# Altium project PCB_Project.PrjPcb
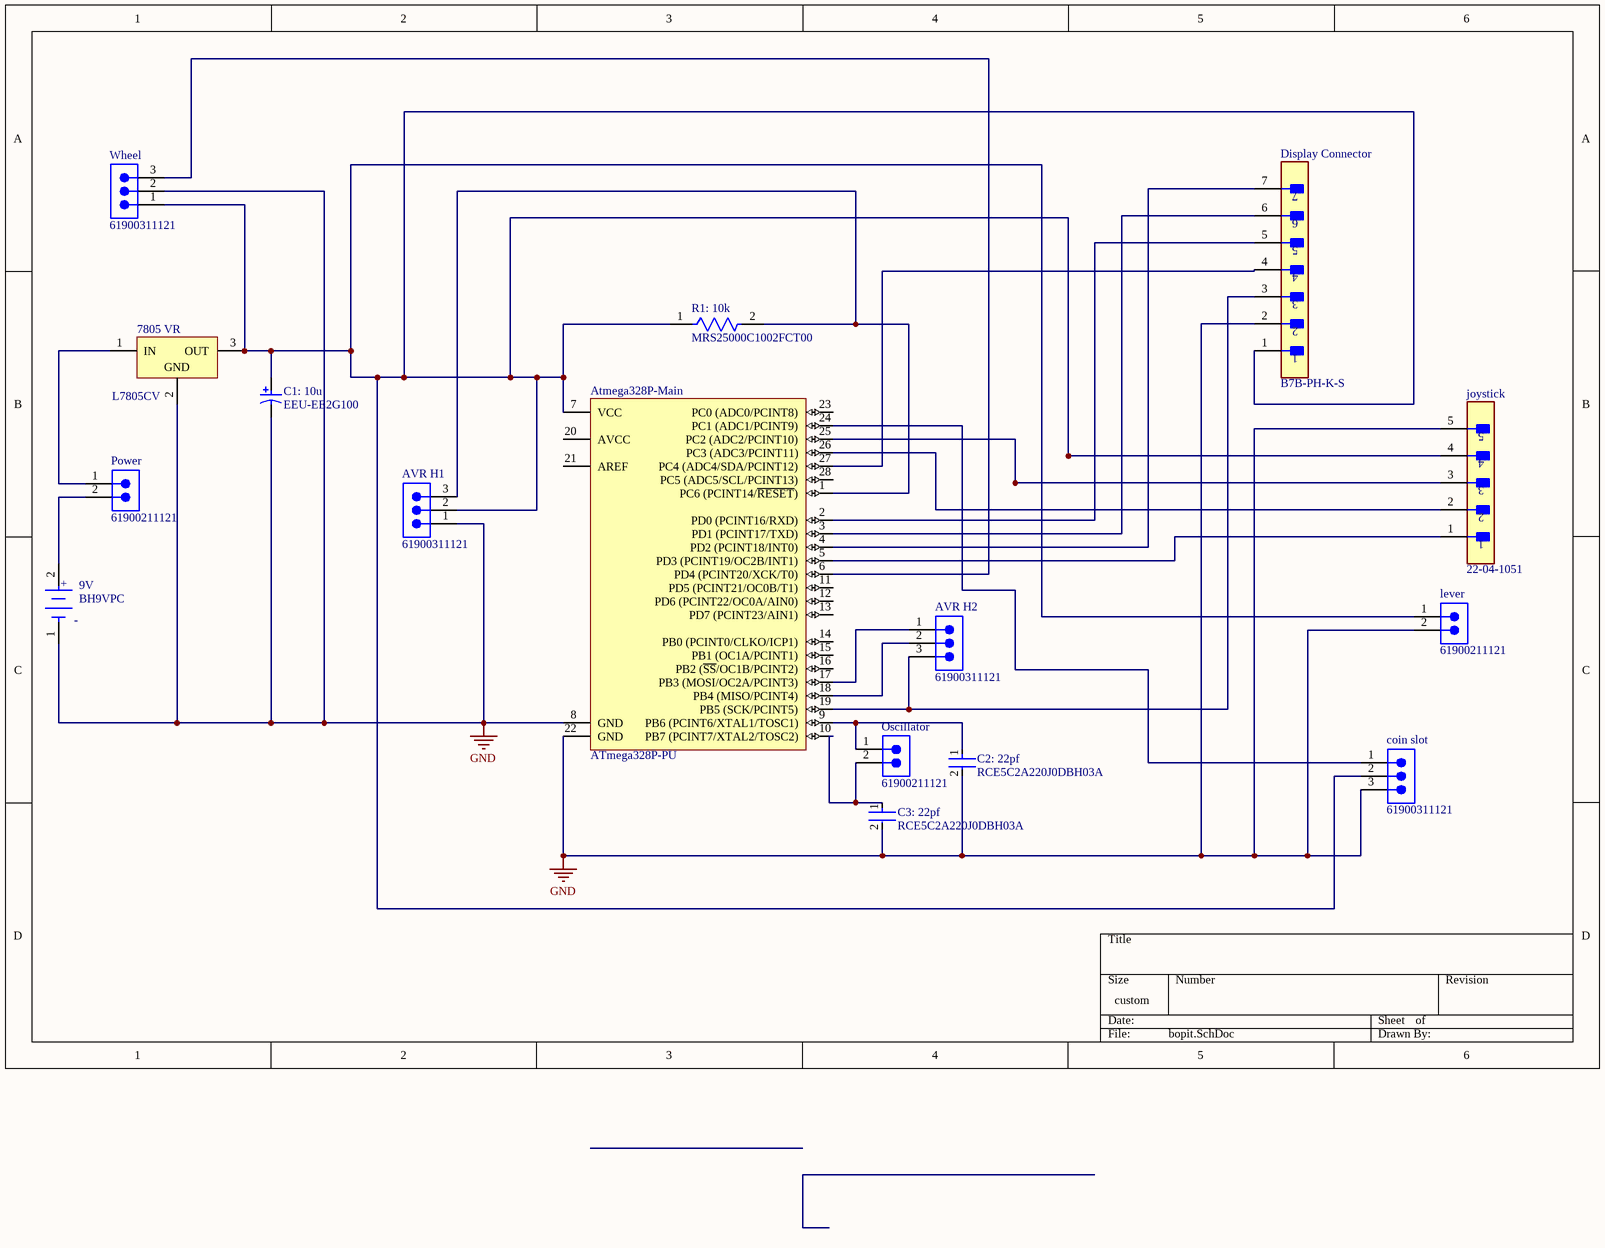
[diagram p0: bopit.SchDoc]
1 sheet, 16 parts. Net scope: global (net labels, ports and power ports of the same name join across sheets).
Board file: Bopit.PcbDoc

## Sheet bopit.SchDoc
size 300 x 200 mm; SheetNumber: 1; SheetTotal: 1

### Parts
9V  BH9VPC  [FP-BH9VPC-MFG]
7805_VR  L7805CV  [TO220]
Atmega328P-Main  ATmega328P-PU  [28P3]
AVR_H1  61900311121  [61900311121]
AVR_H2  61900311121  [61900311121]
C1:_10u  EEU-EE2G100  [PNSC-EEU-EE2G100-2_V]
C2:_22pf  RCE5C2A220J0DBH03A  [FP-RCE0DB-MFG]
C3:_22pf  RCE5C2A220J0DBH03A  [FP-RCE0DB-MFG]
coin_slot  61900311121  [61900311121]
Display_Connector  B7B-PH-K-S  [FP-B7B-PH-K-S-MFG]
joystick  22-04-1051  [FP-22-04-1051-MFG]
lever  61900211121  [61900211121]
Oscillator  61900211121  [61900211121]
Power  61900211121  [61900211121]
R1:_10k  MRS25000C1002FCT00  [FP-MRS25-MFG]
Wheel  61900311121  [61900311121]

### Nets
GND: 9V.1(C) 7805_VR.2(GND) Atmega328P-Main.8(GND) Atmega328P-Main.22(GND) AVR_H1.1 C1:_10u.2 C2:_22pf.2 C3:_22pf.2 coin_slot.3 Display_Connector.2 joystick.5 lever.2 Wheel.2
Net9V_2: 9V.2(A) Power.2
Net7805_VR_1: 7805_VR.1(IN) Power.1
Net7805_VR_3: 7805_VR.3(OUT) Atmega328P-Main.7(VCC) AVR_H1.2 C1:_10u.1 coin_slot.2 Display_Connector.1 joystick.4 lever.1 R1:_10k.1 Wheel.1
NetAtmega328P-Main_1: Atmega328P-Main.1(PC6_(PCINT14/~{RESET})) AVR_H1.3 R1:_10k.2
NetAtmega328P-Main_2: Atmega328P-Main.2(PD0_(PCINT16/RXD)) Display_Connector.5
NetAtmega328P-Main_3: Atmega328P-Main.3(PD1_(PCINT17/TXD)) Display_Connector.6
NetAtmega328P-Main_4: Atmega328P-Main.4(PD2_(PCINT18/INT0)) Display_Connector.7
NetAtmega328P-Main_5: Atmega328P-Main.5(PD3_(PCINT19/OC2B/INT1)) joystick.1
NetAtmega328P-Main_6: Atmega328P-Main.6(PD4_(PCINT20/XCK/T0)) Wheel.3
NetAtmega328P-Main_9: Atmega328P-Main.9(PB6_(PCINT6/XTAL1/TOSC1)) C2:_22pf.1 Oscillator.1
NetAtmega328P-Main_10: Atmega328P-Main.10(PB7_(PCINT7/XTAL2/TOSC2)) C3:_22pf.1 Oscillator.2
NetAtmega328P-Main_17: Atmega328P-Main.17(PB3_(MOSI/OC2A/PCINT3)) AVR_H2.1
NetAtmega328P-Main_18: Atmega328P-Main.18(PB4_(MISO/PCINT4)) AVR_H2.2
NetAtmega328P-Main_19: Atmega328P-Main.19(PB5_(SCK/PCINT5)) AVR_H2.3 Display_Connector.3
NetAtmega328P-Main_24: Atmega328P-Main.24(PC1_(ADC1/PCINT9)) coin_slot.1
NetAtmega328P-Main_25: Atmega328P-Main.25(PC2_(ADC2/PCINT10)) joystick.3
NetAtmega328P-Main_26: Atmega328P-Main.26(PC3_(ADC3/PCINT11)) joystick.2
NetAtmega328P-Main_27: Atmega328P-Main.27(PC4_(ADC4/SDA/PCINT12)) Display_Connector.4

Not connected (* = marked no-connect by the designer): Atmega328P-Main 11(PD5_(PCINT21/OC0B/T1)) 12(PD6_(PCINT22/OC0A/AIN0)) 13(PD7_(PCINT23/AIN1)) 14(PB0_(PCINT0/CLKO/ICP1)) 15(PB1_(OC1A/PCINT1)) 16(PB2_(~{SS}/OC1B/PCINT2)) 20(AVCC) 21(AREF) 23(PC0_(ADC0/PCINT8)) 28(PC5_(ADC5/SCL/PCINT13))

### Notes on the sheet
- (in symbol CMP-136216-000001-1) +; -

### Library data of the parts
9V = CMP-136216-000001-1: BATTERY HOLDER 9V PC PIN; Manufacturer: Memory Protection Devices; Conn Orientation: Vertical; Is Female: yes; Number Of Contacts: 2; Description: Battery Holder (Open) 9V 1 Cell PC Pin; Device Class L2: unset; Contact Material: Nickel; Device Class L1: Connectors; Lead Free: Yes; Digikey Description: BATTERY HOLDER 9V PC PIN; Category: Batt; ComponentLink2URL: http://www.memoryprotectiondevices.com/datasheets/BH9VPC-datasheet.pdf; Device Class L3: unset; Package: 0; Automotive: No; ComponentLink2Description: Datasheet; Height: 21.12mm; Voltage Rating: 9V; Octopart: https://octopart.com/bh9vpc-memory+protection+devices-22788154; RoHS: TRUE; Manufacturer Part Number: BH9VPC
7805_VR = CMP-0244-00483-1: Positive Voltage Regulator, 5V, 3-Pin TO-220; PackageDescription: TO, Thru-Hole, Vertical, Heatsink Mounted; 3 In-Line Leads; Pitch 2.54 mm; ComponentLink2Description: Datasheet; PackageReference: TO220; ComponentLink3URL: http://www.st.com/internet/com/TECHNICAL_RESOURCES/TECHNICAL_LITERATURE/PACKAGE_INFORMATION/CD00004649.pdf; DatasheetVersion: 16/11/2011; ComponentLink1Description: Manufacturer URL; ComponentLink1URL: http://www.st.com; PackageVersion: ver3.0; ComponentLink3Description: Package Specification; ComponentLink2URL: http://www.st.com/internet/com/TECHNICAL_RESOURCES/TECHNICAL_LITERATURE/DATASHEET/CD00000444.pdf
Atmega328P-Main = CMP-0095-00013-2: 8-bit AVR Microcontroller, 32KB Flash, 1KB EEPROM, 2KB SRAM, 28-pin PDIP, Industrial Grade (-40°C to 85°C); RevisionNote: DatasheetVersion updated. URLs added.; PackageVersion: revB, Sep-2001; PackageDescription: 28-lead (0.300"/7.62mm Wide) Plastic Dual Inline Package (PDIP); DatasheetVersion: revD, May-2011; ComponentLink1Description: Manufacturer URL; ComponentLink1URL: http://www.atmel.com/; PackageReference: 28P3; ComponentLink2Description: ATmega48A/48PA/88A/88PA/168A/168PA/328/328P Datasheet; ComponentLink3URL: http://www.atmel.com/dyn/resources/prod_documents/8271S.pdf; ComponentLink2URL: http://www.atmel.com/dyn/resources/prod_documents/8271.pdf; ComponentLink3Description: ATmega48A/48PA/88A/88PA/168A/168PA/328/328P Summary
AVR_H1 AVR_H2 coin_slot Wheel = CMP-1502-00585-2: NexarPartId: 18818222; Current Rating: 3A; Voltage Rating: 250V; Number of Positions: 3; Insulation Resistance: 1GΩ; Gender: Male; Pitch: 2.54mm; Connector Type: Male Pin; Contact Resistance: 20mΩ; Termination: Through Hole; Width: 7.66mm; Contact Plating: Tin; Orientation: Vertical; Mount: Through Hole; Contact Gender: Male; Max Operating Temperature: 105°C; Length: 7.62mm; Number of Rows: 1; Height: 12.5mm; Lead Pitch: 2.54mm; Housing Material: Nylon; Color: Beige; Contact Material: Copper; Fastening Type: Friction; Min Operating Temperature: -40°C; Number of Contacts: 3; Number of Pins: 3; Flammability Rating: UL94 V-0; Contact Mating Length: 7.493mm; RoHS: Compliant; REACH SVHC: Unknown; Packaging: Bulk; Operating Supply Voltage: 250V
C1:_10u = CMP-0736-00002-1: Aluminum Electrolytic Capacitor, 10 uF +/- 20%, 400 V, -25 to 105 degC, 2-Pin 10 x 10 x 22 mm Through-hole, RoHS, Tape and Reel; Manufacturer: Panasonic; Ripple Current: 430 mA; Rated Voltage: 400 V; Cap.: 10 uF; Capacitance Tolerance: +/- 20%; ComponentLink2URL: http://industrial.panasonic.com/www-data/pdf/ABA0000/ABA0000CE113.pdf; Mounting Technology: Through Hole; PackageVersion: Nov-12; ComponentLink3URL: http://industrial.panasonic.com/www-data/pdf/ABA0000/ABA0000PE245.pdf; ComponentLink2Description: Datasheet; PartNumber: EEU-EE2G100; DatasheetVersion: Nov-12; PackageDescription: 2-Pin Through-hole, Base 10 x 10 mm, Height 22 mm; PackageReference: EEU-EE2G100-2; ComponentLink1URL: http://industrial.panasonic.com/; Temp. Range: -25 to 105 degC; RoHS: TRUE; Packing: Tape and Reel; ComponentLink1Description: Manufacturer URL; ComponentLink3Description: Package Specification
C2:_22pf C3:_22pf = CMP-06035-047347-1: Cap Ceramic 22pF 100V C0G ±5% Radial 2.5mm +125°C Ammo Pack; Lead Diameter: 0.5mm; Lead/Base Style: Straight; Height: 3.5mm; Voltage: 100V; Mount: Through Hole; Min Operating Temperature: -55°C; Height - Seated (Max): 0.138inch; Dielectric: C0G; Width: 0.098inch; Depth: 2.5mm; Lead Pitch: 0.098inch; Packaging: Tape and Reel; Voltage Rating (DC): 100V; Capacitance: 22pF; Package Quantity: 2000; Max Operating Temperature: 125°C; Tolerance: 5%; Termination: Radial; Voltage Rating: 100V; Case/Package: Radial; Resistor Type: Ceramic; Length: 3.6mm; Ratings: AEC-Q200
Display_Connector = CMP-17439-000359-1: CONN HEADER VERT 7POS 2MM; Contact Resistance: 10mR; Current Rating: 2A; Pitch: 0.079inch; Test Voltage: 800V; Gender: Male; Insulation Resistance: 1GR; Connector Type: Male Pin; Number of Contacts: 7; Contact Mating Length: 0.13inch; Color: Natural; Contact Material: Bronze; Contact Plating: Tin; Series: PH; Housing Color: Natural; Fastening Type: Detent; Orientation: Vertical; Mount: Through Hole; Housing Material: Nylon; Contact Type: Male Pin; Packaging: Bulk; Lead Free: Contains Lead; Number of Rows: 1; Package Quantity: 500; Termination: Press-Fit; Number of Positions: 7
joystick = CMP-00257-00247488-1: 22-04-1051 KK Mini-Latch Straight Male, PCB Header, Through Hole, 1 Rows, 5 Contacts, 2.5mm Pitch; Manufacturer Lifecycle Status: ACTIVE; NexarPartId: 247488; Insulation Resistance: 1GΩ; Current Rating: 3A; Glow Wire Compliant: Non-compliant; Plating: Tin; Number of Circuits: 5; Voltage Rating: 250V; Contact Resistance: 20mΩ; Connector Type: Male Pin; Max Voltage Rating (DC): 250.25kV; Termination: Solder; Number of Rows: 1; REACH SVHC: Unknown; Number of Pins: 5; Length: 12mm; Pitch: 2.5mm; Schedule B: 8536694040; Min Operating Temperature: -40°C; RoHS: Compliant; Radiation Hardening: No; Contact Mating Length: 7.493mm; Packaging: Bulk; Halogen Free: Low Halogen; Housing Color: Natural; Max Operating Temperature: 105°C; Housing Material: Nylon; Lead Pitch: 2.5mm; Max Voltage Rating (AC): 250V; Number of Positions: 5; Gender: Male; Material: Nylon; Contact Plating: Tin; Depth: 4.9mm; Flammability Rating: UL94 V-0; Lead Free: Lead Free; Fastening Type: Friction; Color: Natural; Orientation: Vertical; Lifecycle Status: Production; Number of Contacts: 5; Voltage Rating (DC): 250V; Voltage Rating (AC): 250V; Country of Origin: TW; Contact Material: Brass; Mount: Through Hole
lever Oscillator Power = CMP-1502-00584-3: NexarPartId: 18818218; Gender: Male; Connector Type: Male Pin; Insulation Resistance: 1GΩ; Contact Resistance: 20mΩ; Number of Contacts: 2; Operating Supply Voltage: 250V; Current Rating: 3A; Pitch: 2.54mm; Color: Beige; Fastening Type: Friction; Number of Pins: 2; Lead Pitch: 2.54mm; Orientation: Vertical; Max Operating Temperature: 105°C; Contact Mating Length: 7.493mm; RoHS: Compliant; Voltage Rating: 250V; Number of Positions: 2; Mount: Through Hole; Length: 5.08mm; Contact Plating: Tin; Width: 5.12mm; Termination: Through Hole; Flammability Rating: UL94 V-0; Min Operating Temperature: -40°C; Housing Material: Nylon; Contact Gender: Male; Number of Rows: 1; Packaging: Bulk; REACH SVHC: Unknown; Contact Material: Copper; Height: 11.75mm
R1:_10k = CMP-00030-42632392-1: MRS25000C1002FCT00 Resistor, 10 kOhm, ± 1%, 600 mW, Axial Leaded, Metal Film (Thin Film), Professional; Power Rating: 600mW; Voltage Rating (DC): 350V; Lead Length: 26mm; Resistance: 10kΩ; Temperature Coefficient: 50ppm/°C; Termination: Axial; Number of Terminations: 2; Diameter: 2.5mm; Composition: Metal Film, Thin Film; Number of Pins: 2; Length: 6.5mm; Military Standard: Not; RoHS: Compliant; NexarPartId: 42632392; Width: 2.5mm; Radiation Hardening: No; Voltage Rating: 350V; Max Power Dissipation: 600mW; Min Operating Temperature: -55°C; Lead Free: Lead Free; Max Operating Temperature: 155°C; Tolerance: 1%; Schedule B: 8533210090, 8533210090; Contact Plating: Tin; Mount: Through Hole; REACH SVHC: Unknown; Case/Package: Conformal